# Altium project ALARA_V2.1_Rocketry_PCB.PrjPcb (part 2 of 2)

## Sheet Jumpers High Low.SchDoc
size A; SheetNumber: 7; SheetTotal: 9
Used 14 times, as channels J0, J1, J2, J3, J4, J5, J6, J7, J8, J9, J10, J11, J12, J13. Parts and nets are listed once, with the designators drawn on the sheet.
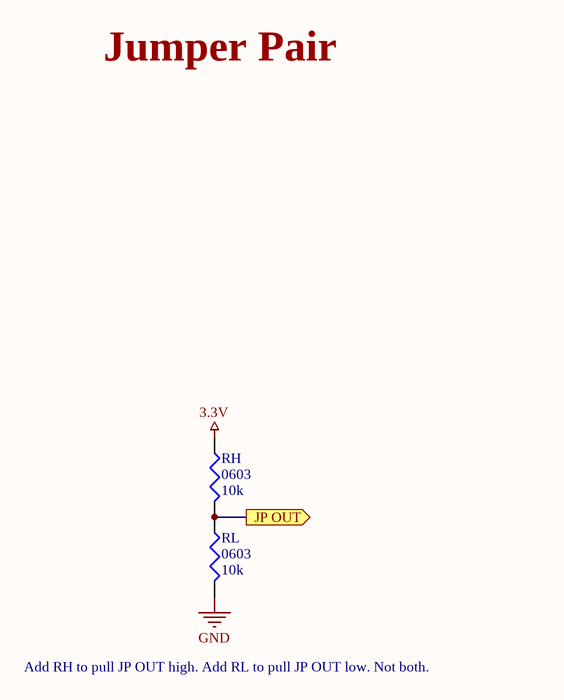
[diagram p9: Jumpers High Low.SchDoc]

### Parts
RH  0603  value 10k  [J1-0603]
RL  0603  value 10k  [J1-0603]

### Ports
JP OUT (out)

### Nets
3.3V: RH.1
GND: RL.2
JP OUT: RH.2 RL.1 ; port JP OUT

### Channels
J0: designators end in _J0; ports JP OUT=ADDR0
J1: designators end in _J1; ports JP OUT=ADDR1
J2: designators end in _J2; ports JP OUT=ADDR2
J3: designators end in _J3; ports JP OUT=ADDR3
J4: designators end in _J4; ports JP OUT=ADDR4
J5: designators end in _J5; ports JP OUT=ADDR5
J6: designators end in _J6; ports JP OUT=ADDR6
J7: designators end in _J7; ports JP OUT=ADDR7
J8: designators end in _J8; ports JP OUT=ADDR8
J9: designators end in _J9; ports JP OUT=ADDR9
J10: designators end in _J10; ports JP OUT=ADDR10
J11: designators end in _J11; ports JP OUT=ADDR11
J12: designators end in _J12; ports JP OUT=ADDR12
J13: designators end in _J13; ports JP OUT=ADDR13

### Notes on the sheet
- Jumper Pair
- Add RH to pull JP OUT high. Add RL to pull JP OUT low. Not both.

### Library data of the parts
RH RL = Res3: Resistor; Published: 8-Jun-2000; LatestRevisionDate: 29-May-2009; LatestRevisionNote: IPC-7351 Footprint Added.; PackageReference: J1-0603; Publisher: Altium Limited; PackageDescription: Chip Resistor

## Sheet RGB LED.SchDoc
size A; SheetNumber: 8; SheetTotal: 9
Used 2 times, as channels L1, L2. Parts and nets are listed once, with the designators drawn on the sheet.
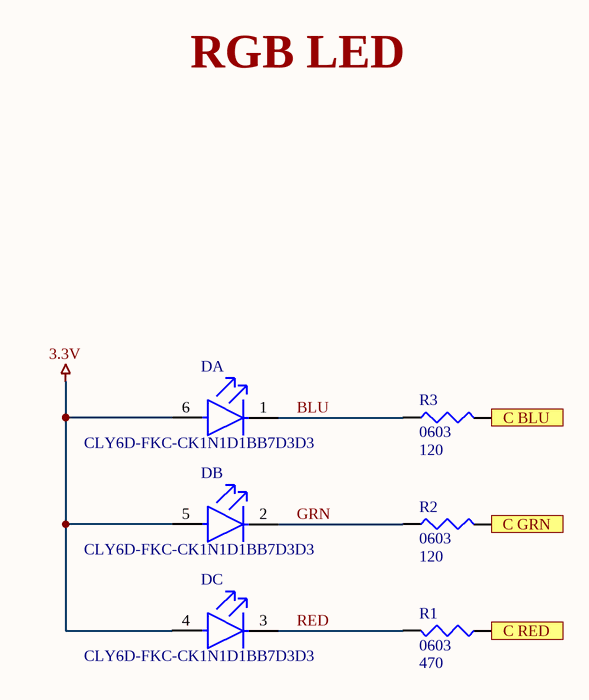
[diagram p10: RGB LED.SchDoc]

### Parts
D  CLY6D-FKC-CK1N1D1BB7D3D3  [FP-CLY6D-FKC-MFG]  (parts A,B,C of 3)
R1  0603  value 470  [J1-0603]
R2  0603  value 120  [J1-0603]
R3  0603  value 120  [J1-0603]

### Ports
C BLU (out), C GRN (out), C RED (out)

### Nets
3.3V: D.4(RED(A)) D.5(GREEN(A)) D.6(BLUE(A))
BLU: D.1(BLUE(C)) R3.1
C BLU: R3.2 ; port C BLU
C GRN: R2.2 ; port C GRN
C RED: R1.1 ; port C RED
GRN: D.2(GREEN(C)) R2.1
RED: D.3(RED(C)) R1.2

### Channels
L1: designators end in _L1; ports C BLU=Out BLU1 C GRN=Out GRN1 C RED=Out RED1
L2: designators end in _L2; ports C BLU=Out BLU2 C GRN=Out GRN2 C RED=Out RED2

### Notes on the sheet
- RGB LED

### Library data of the parts
D = CMP-13977-000015-1: LED RGB DIFFUSED 6PLCC SMD; Forward Voltage: 3V; Luminous Intensity: 240mcd; Lens Color: White; Dominant Wavelength: 470nm; Test Current: 10mA; Color: Blue; Lens Transparency: Diffused; Width: 2.8mm; Height: 2.6mm; Mount: Surface Mount; Length: 2.8mm; Case/Package: SMD/SMT; Packaging: Tape and Reel
R1-R3 = Res3: Resistor; Published: 8-Jun-2000; LatestRevisionDate: 29-May-2009; LatestRevisionNote: IPC-7351 Footprint Added.; PackageReference: J1-0603; Publisher: Altium Limited; PackageDescription: Chip Resistor

## Sheet PTC Fuse.SchDoc
size A; SheetNumber: 9; SheetTotal: 9
Used 5 times, as channels PTC1, PTC2, PTC3, PTC4, PTC5. Parts and nets are listed once, with the designators drawn on the sheet.
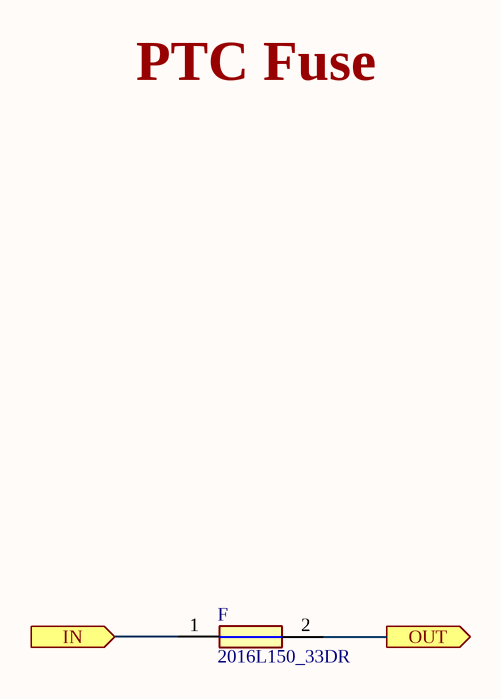
[diagram p11: PTC Fuse.SchDoc]

### Parts
F  2016L150_33DR  [FUSC5141X160N]

### Ports
IN (in), OUT (out)

### Nets
IN: F.1 ; port IN
OUT: F.2 ; port OUT

### Channels
PTC1: designators end in _PTC1; ports IN=BAT+ OUT=HPO BAT+1
PTC2: designators end in _PTC2; ports IN=BAT+ OUT=HPO BAT+2
PTC3: designators end in _PTC3; ports IN=BAT+ OUT=HPO BAT+3
PTC4: designators end in _PTC4; ports IN=BAT+ OUT=HPO BAT+4
PTC5: designators end in _PTC5; ports IN=BAT+ OUT=HPO BAT+5

### Notes on the sheet
- PTC Fuse

### Library data of the parts
F = 2016L150_33DR: Fuse; Manufacturer_Name: LITTELFUSE; Manufacturer_Part_Number: 2016L150/33DR; Datasheet Link: https://componentsearchengine.com//2016L150_33DR.pdf; Height: 1.6mm; Mouser2 Part Number: 576-2016L150/33DR; Mouser2 Price/Stock: https://www.mouser.com/Search/Refine.aspx?Keyword=576-2016L150%2F33DR

## Nets that join several sheets
3.3V: Sheet1 (67 pins), N1 (5 pins), N2 (5 pins), N3 (5 pins), N4 (5 pins), N5 (5 pins), N6 (5 pins), N7 (5 pins), N8 (5 pins), CAN Bus (5 pins), J0 (RH_J0.1), J1 (RH_J1.1), J2 (RH_J2.1), J3 (RH_J3.1), J4 (RH_J4.1), J5 (RH_J5.1), J6 (RH_J6.1), J7 (RH_J7.1), L1 (D_L1.4 D_L1.5 D_L1.6), L2 (D_L2.4 D_L2.5 D_L2.6), J8 (RH_J8.1), J9 (RH_J9.1), J10 (RH_J10.1), J11 (RH_J11.1), J12 (RH_J12.1), J13 (RH_J13.1)
5V: Sheet1 (15 pins), CAN Bus (C5.2 CAN_T.3)
GND: Sheet1 (115 pins), N1 (FL_N1.4), N2 (FL_N2.4), N3 (FL_N3.4), N4 (FL_N4.4), N5 (FL_N5.4), N6 (FL_N6.4), N7 (FL_N7.4), N8 (FL_N8.4), H1 (7 pins), H2 (7 pins), H3 (7 pins), H4 (7 pins), H5 (7 pins), H6 (7 pins), H7 (7 pins), H8 (7 pins), H9 (7 pins), H10 (7 pins), O1 (OP_O1.2 OP_O1.4), O2 (OP_O2.2 OP_O2.4), O3 (OP_O3.2 OP_O3.4), O4 (OP_O4.2 OP_O4.4), O5 (OP_O5.2 OP_O5.4), O6 (OP_O6.2 OP_O6.4), O7 (OP_O7.2 OP_O7.4), O8 (OP_O8.2 OP_O8.4), O9 (OP_O9.2 OP_O9.4), O10 (OP_O10.2 OP_O10.4), F1 (C_F1.1 R2_F1.2), F2 (C_F2.1 R2_F2.2), F3 (C_F3.1 R2_F3.2), F4 (C_F4.1 R2_F4.2), F5 (C_F5.1 R2_F5.2), F6 (C_F6.1 R2_F6.2), F7 (C_F7.1 R2_F7.2), F8 (C_F8.1 R2_F8.2), CAN Bus (12 pins), J0 (RL_J0.2), J1 (RL_J1.2), J2 (RL_J2.2), J3 (RL_J3.2), J4 (RL_J4.2), J5 (RL_J5.2), J6 (RL_J6.2), J7 (RL_J7.2), J8 (RL_J8.2), J9 (RL_J9.2), J10 (RL_J10.2), J11 (RL_J11.2), J12 (RL_J12.2), J13 (RL_J13.2)
ADDR0: Sheet1 (DEMUX.4), J0 (RH_J0.2 RL_J0.1)
ADDR1: Sheet1 (DEMUX.3), J1 (RH_J1.2 RL_J1.1)
ADDR2: Sheet1 (DEMUX.2), J2 (RH_J2.2 RL_J2.1)
ADDR3: Sheet1 (DEMUX.1), J3 (RH_J3.2 RL_J3.1)
ADDR4: Sheet1 (DEMUX.15), J4 (RH_J4.2 RL_J4.1)
ADDR5: Sheet1 (DEMUX.14), J5 (RH_J5.2 RL_J5.1)
ADDR6: Sheet1 (DEMUX.13), J6 (RH_J6.2 RL_J6.1)
ADDR7: Sheet1 (DEMUX.12), J7 (RH_J7.2 RL_J7.1)
ADDR8: Sheet1 (PWM_DRIVER.1), J8 (RH_J8.2 RL_J8.1)
ADDR9: Sheet1 (PWM_DRIVER.2), J9 (RH_J9.2 RL_J9.1)
ADDR10: Sheet1 (PWM_DRIVER.3), J10 (RH_J10.2 RL_J10.1)
ADDR11: Sheet1 (PWM_DRIVER.4), J11 (RH_J11.2 RL_J11.1)
ADDR12: Sheet1 (PWM_DRIVER.5), J12 (RH_J12.2 RL_J12.1)
ADDR13: Sheet1 (PWM_DRIVER.24), J13 (RH_J13.2 RL_J13.1)
AIN1: Sheet1 (MCU.81), F1 (C_F1.2 R1_F1.2 R2_F1.1)
AIN2: Sheet1 (MCU.82), F2 (C_F2.2 R1_F2.2 R2_F2.1)
AIN3: Sheet1 (MCU.46), F3 (C_F3.2 R1_F3.2 R2_F3.1)
AIN4: Sheet1 (MCU.45), F4 (C_F4.2 R1_F4.2 R2_F4.1)
AIN5: Sheet1 (MCU.39), F5 (C_F5.2 R1_F5.2 R2_F5.1)
AIN6: Sheet1 (MCU.38), F6 (C_F6.2 R1_F6.2 R2_F6.1)
AIN7: Sheet1 (MCU.30), F7 (C_F7.2 R1_F7.2 R2_F7.1)
AIN8: Sheet1 (MCU.29), F8 (C_F8.2 R1_F8.2 R2_F8.1)
BAT+: Sheet1 (BUCK.1 C101.1 J1.1 R101.2), H1 (D1_H1.1 R1_H1.2 R3_H1.2 R7_H1.2), H2 (D1_H2.1 R1_H2.2 R3_H2.2 R7_H2.2), H3 (D1_H3.1 R1_H3.2 R3_H3.2 R7_H3.2), H4 (D1_H4.1 R1_H4.2 R3_H4.2 R7_H4.2), H5 (D1_H5.1 R1_H5.2 R3_H5.2 R7_H5.2), H6 (D1_H6.1 R1_H6.2 R3_H6.2 R7_H6.2), H7 (D1_H7.1 R1_H7.2 R3_H7.2 R7_H7.2), H8 (D1_H8.1 R1_H8.2 R3_H8.2 R7_H8.2), H9 (D1_H9.1 R1_H9.2 R3_H9.2 R7_H9.2), H10 (D1_H10.1 R1_H10.2 R3_H10.2 R7_H10.2), PTC1 (F_PTC1.1), PTC2 (F_PTC2.1), PTC3 (F_PTC3.1), PTC4 (F_PTC4.1), PTC5 (F_PTC5.1)
CANF CLKO: Sheet1 (MCU.75), CAN Bus (CAN_C.3)
CANF CS: Sheet1 (MCU.68), CAN Bus (CAN_C.13 R2.1)
CANF INTN: Sheet1 (MCU.76), CAN Bus (CAN_C.4)
CANF INTN0: Sheet1 (MCU.67), CAN Bus (CAN_C.9)
CANF INTN1: Sheet1 (MCU.55), CAN Bus (CAN_C.8)
CANF_N: Sheet1 (Primary_Connector.47), CAN Bus (CAN_T.6 R1.2)
CANF_P: Sheet1 (Primary_Connector.22), CAN Bus (CAN_T.7 R1.1)
EX AIN1: Sheet1 (Secondary_Connector.1), F1 (R1_F1.1)
EX AIN2: Sheet1 (Secondary_Connector.3), F2 (R1_F2.1)
EX AIN3: Sheet1 (Secondary_Connector.4), F3 (R1_F3.1)
EX AIN4: Sheet1 (Secondary_Connector.6), F4 (R1_F4.1)
EX AIN5: Sheet1 (Secondary_Connector.7), F5 (R1_F5.1)
EX AIN6: Sheet1 (Secondary_Connector.9), F6 (R1_F6.1)
EX AIN7: Sheet1 (Secondary_Connector.10), F7 (R1_F7.1)
EX AIN8: Sheet1 (Secondary_Connector.12), F8 (R1_F8.1)
HPO BAT+1: Sheet1 (Primary_Connector.2 Primary_Connector.4 Primary_Connector.27 Primary_Connector.29), PTC1 (F_PTC1.2)
HPO BAT+2: Sheet1 (Primary_Connector.6 Primary_Connector.8 Primary_Connector.31 Primary_Connector.33), PTC2 (F_PTC2.2)
HPO BAT+3: Sheet1 (Primary_Connector.10 Primary_Connector.12 Primary_Connector.35 Primary_Connector.37), PTC3 (F_PTC3.2)
HPO BAT+4: Sheet1 (Primary_Connector.14 Primary_Connector.16 Primary_Connector.39 Primary_Connector.41), PTC4 (F_PTC4.2)
HPO BAT+5: Sheet1 (Primary_Connector.18 Primary_Connector.20 Primary_Connector.43 Primary_Connector.45), PTC5 (F_PTC5.2)
HPO D1: Sheet1 (Primary_Connector.1 Primary_Connector.26), H1 (7 pins)
HPO D2: Sheet1 (Primary_Connector.3 Primary_Connector.28), H2 (7 pins)
HPO D3: Sheet1 (Primary_Connector.5 Primary_Connector.30), H3 (7 pins)
HPO D4: Sheet1 (Primary_Connector.7 Primary_Connector.32), H4 (7 pins)
HPO D5: Sheet1 (Primary_Connector.9 Primary_Connector.34), H5 (7 pins)
HPO D6: Sheet1 (Primary_Connector.11 Primary_Connector.36), H6 (7 pins)
HPO D7: Sheet1 (Primary_Connector.13 Primary_Connector.38), H7 (7 pins)
HPO D8: Sheet1 (Primary_Connector.15 Primary_Connector.40), H8 (7 pins)
HPO D9: Sheet1 (Primary_Connector.17 Primary_Connector.42), H9 (7 pins)
HPO D10: Sheet1 (Primary_Connector.19 Primary_Connector.44), H10 (7 pins)
HPO DIG1: Sheet1 (MCU.139), O1 (R2_O1.2)
HPO DIG2: Sheet1 (MCU.126), O2 (R2_O2.2)
HPO DIG3: Sheet1 (MCU.125), O3 (R2_O3.2)
HPO DIG4: Sheet1 (MCU.124), O4 (R2_O4.2)
HPO DIG5: Sheet1 (MCU.123), O5 (R2_O5.2)
HPO DIG6: Sheet1 (MCU.120), O6 (R2_O6.2)
HPO DIG7: Sheet1 (MCU.119), O7 (R2_O7.2)
HPO DIG8: Sheet1 (MCU.118), O8 (R2_O8.2)
HPO DIG9: Sheet1 (MCU.117), O9 (R2_O9.2)
HPO DIG10: Sheet1 (MCU.90), O10 (R2_O10.2)
HPO PWM1: Sheet1 (MCU.136), O1 (R1_O1.2)
HPO PWM2: Sheet1 (MCU.131), O2 (R1_O2.2)
HPO PWM3: Sheet1 (MCU.130), O3 (R1_O3.2)
HPO PWM4: Sheet1 (MCU.129), O4 (R1_O4.2)
HPO PWM5: Sheet1 (MCU.127), O5 (R1_O5.2)
HPO PWM6: Sheet1 (MCU.113), O6 (R1_O6.2)
HPO PWM7: Sheet1 (MCU.109), O7 (R1_O7.2)
HPO PWM8: Sheet1 (MCU.106), O8 (R1_O8.2)
HPO PWM9: Sheet1 (MCU.105), O9 (R1_O9.2)
HPO PWM10: Sheet1 (MCU.104), O10 (R1_O10.2)
HPO VD1: Sheet1 (MCU.133), H1 (C_H1.2 R5_H1.1 R6_H1.2)
HPO VD2: Sheet1 (MCU.132), H2 (C_H2.2 R5_H2.1 R6_H2.2)
HPO VD3: Sheet1 (MCU.128), H3 (C_H3.2 R5_H3.1 R6_H3.2)
HPO VD4: Sheet1 (MCU.116), H4 (C_H4.2 R5_H4.1 R6_H4.2)
HPO VD5: Sheet1 (MCU.115), H5 (C_H5.2 R5_H5.1 R6_H5.2)
HPO VD6: Sheet1 (MCU.114), H6 (C_H6.2 R5_H6.1 R6_H6.2)
HPO VD7: Sheet1 (MCU.103), H7 (C_H7.2 R5_H7.1 R6_H7.2)
HPO VD8: Sheet1 (MCU.92), H8 (C_H8.2 R5_H8.1 R6_H8.2)
HPO VD9: Sheet1 (MCU.91), H9 (C_H9.2 R5_H9.1 R6_H9.2)
HPO VD10: Sheet1 (MCU.86), H10 (C_H10.2 R5_H10.1 R6_H10.2)
MISO: Sheet1 (7 pins), N1 (FL_N1.2), N2 (FL_N2.2), N3 (FL_N3.2), N4 (FL_N4.2), N5 (FL_N5.2), N6 (FL_N6.2), N7 (FL_N7.2), N8 (FL_N8.2), CAN Bus (CAN_C.12)
MOSI: Sheet1 (6 pins), N1 (FL_N1.5), N2 (FL_N2.5), N3 (FL_N3.5), N4 (FL_N4.5), N5 (FL_N5.5), N6 (FL_N6.5), N7 (FL_N7.5), N8 (FL_N8.5), CAN Bus (CAN_C.11)
MUX B1: Sheet1 (MUX.4), N1 (FL_N1.1 R1_N1.2)
MUX B2: Sheet1 (MUX.3), N2 (FL_N2.1 R1_N2.2)
MUX B3: Sheet1 (MUX.2), N3 (FL_N3.1 R1_N3.2)
MUX B4: Sheet1 (MUX.1), N4 (FL_N4.1 R1_N4.2)
MUX B5: Sheet1 (MUX.15), N5 (FL_N5.1 R1_N5.2)
MUX B6: Sheet1 (MUX.14), N6 (FL_N6.1 R1_N6.2)
MUX B7: Sheet1 (MUX.13), N7 (FL_N7.1 R1_N7.2)
MUX B8: Sheet1 (MUX.12), N8 (FL_N8.1 R1_N8.2)
OP1H1: H1 (R3_H1.1), O1 (OP_O1.8)
OP1H2: H2 (R3_H2.1), O2 (OP_O2.8)
OP1H3: H3 (R3_H3.1), O3 (OP_O3.8)
OP1H4: H4 (R3_H4.1), O4 (OP_O4.8)
OP1H5: H5 (R3_H5.1), O5 (OP_O5.8)
OP1H6: H6 (R3_H6.1), O6 (OP_O6.8)
OP1H7: H7 (R3_H7.1), O7 (OP_O7.8)
OP1H8: H8 (R3_H8.1), O8 (OP_O8.8)
OP1H9: H9 (R3_H9.1), O9 (OP_O9.8)
OP1H10: H10 (R3_H10.1), O10 (OP_O10.8)
OP1L1: H1 (Q_H1.8 R4_H1.2), O1 (OP_O1.7)
OP1L2: H2 (Q_H2.8 R4_H2.2), O2 (OP_O2.7)
OP1L3: H3 (Q_H3.8 R4_H3.2), O3 (OP_O3.7)
OP1L4: H4 (Q_H4.8 R4_H4.2), O4 (OP_O4.7)
OP1L5: H5 (Q_H5.8 R4_H5.2), O5 (OP_O5.7)
OP1L6: H6 (Q_H6.8 R4_H6.2), O6 (OP_O6.7)
OP1L7: H7 (Q_H7.8 R4_H7.2), O7 (OP_O7.7)
OP1L8: H8 (Q_H8.8 R4_H8.2), O8 (OP_O8.7)
OP1L9: H9 (Q_H9.8 R4_H9.2), O9 (OP_O9.7)
OP1L10: H10 (Q_H10.8 R4_H10.2), O10 (OP_O10.7)
OP2H1: H1 (R1_H1.1), O1 (OP_O1.6)
OP2H2: H2 (R1_H2.1), O2 (OP_O2.6)
OP2H3: H3 (R1_H3.1), O3 (OP_O3.6)
OP2H4: H4 (R1_H4.1), O4 (OP_O4.6)
OP2H5: H5 (R1_H5.1), O5 (OP_O5.6)
OP2H6: H6 (R1_H6.1), O6 (OP_O6.6)
OP2H7: H7 (R1_H7.1), O7 (OP_O7.6)
OP2H8: H8 (R1_H8.1), O8 (OP_O8.6)
OP2H9: H9 (R1_H9.1), O9 (OP_O9.6)
OP2H10: H10 (R1_H10.1), O10 (OP_O10.6)
OP2L1: H1 (Q_H1.1 R2_H1.2), O1 (OP_O1.5)
OP2L2: H2 (Q_H2.1 R2_H2.2), O2 (OP_O2.5)
OP2L3: H3 (Q_H3.1 R2_H3.2), O3 (OP_O3.5)
OP2L4: H4 (Q_H4.1 R2_H4.2), O4 (OP_O4.5)
OP2L5: H5 (Q_H5.1 R2_H5.2), O5 (OP_O5.5)
OP2L6: H6 (Q_H6.1 R2_H6.2), O6 (OP_O6.5)
OP2L7: H7 (Q_H7.1 R2_H7.2), O7 (OP_O7.5)
OP2L8: H8 (Q_H8.1 R2_H8.2), O8 (OP_O8.5)
OP2L9: H9 (Q_H9.1 R2_H9.2), O9 (OP_O9.5)
OP2L10: H10 (Q_H10.1 R2_H10.2), O10 (OP_O10.5)
Out BLU1: Sheet1 (PWM_DRIVER.11), L1 (R3_L1.2)
Out BLU2: Sheet1 (PWM_DRIVER.8), L2 (R3_L2.2)
Out GRN1: Sheet1 (PWM_DRIVER.10), L1 (R2_L1.2)
Out GRN2: Sheet1 (PWM_DRIVER.7), L2 (R2_L2.2)
Out RED1: Sheet1 (PWM_DRIVER.9), L1 (R1_L1.1)
Out RED2: Sheet1 (PWM_DRIVER.6), L2 (R1_L2.1)
SCLK: Sheet1 (6 pins), N1 (FL_N1.6), N2 (FL_N2.6), N3 (FL_N3.6), N4 (FL_N4.6), N5 (FL_N5.6), N6 (FL_N6.6), N7 (FL_N7.6), N8 (FL_N8.6), CAN Bus (CAN_C.10)